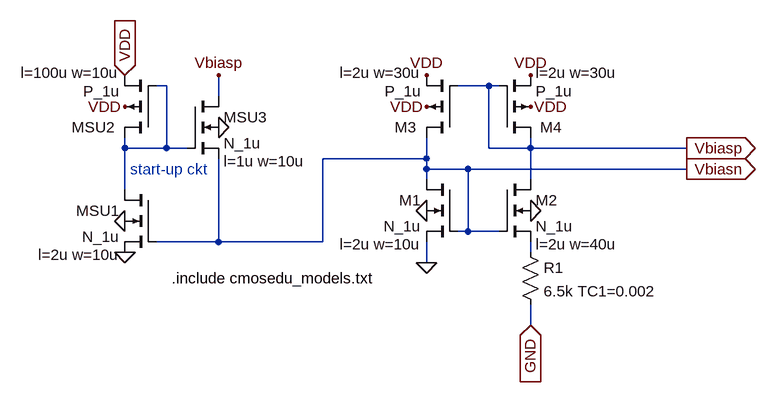
[diagram p0: schematic Fig_20_15.asc]
Fig_20_15.asc, the LTspice schematic file:
Version 4
SHEET 1 1556 680
WIRE 608 -80 592 -80
WIRE 1104 -80 1056 -80
WIRE 1120 -80 1104 -80
WIRE 688 -64 688 -96
WIRE 544 16 544 0
WIRE 608 16 608 -80
WIRE 608 16 544 16
WIRE 640 16 608 16
WIRE 1104 16 1104 -80
WIRE 1168 16 1168 0
WIRE 1168 16 1104 16
WIRE 1408 16 1168 16
WIRE 1008 32 1008 0
WIRE 1008 32 848 32
WIRE 1008 48 1008 32
WIRE 1072 48 1008 48
WIRE 1408 48 1072 48
WIRE 1008 64 1008 48
WIRE 1168 64 1168 16
WIRE 544 80 544 16
WIRE 1072 144 1072 48
WIRE 1072 144 1056 144
WIRE 1120 144 1072 144
WIRE 688 160 688 32
WIRE 688 160 592 160
WIRE 848 160 848 32
WIRE 848 160 688 160
WIRE 544 176 544 160
WIRE 1168 176 1168 160
WIRE 1008 192 1008 160
WIRE 1168 288 1168 256
FLAG 544 -48 VDD
FLAG 544 128 0
FLAG 688 -16 0
FLAG 688 -96 Vbiasp
FLAG 1008 -48 VDD
FLAG 1008 -96 VDD
FLAG 1168 -48 VDD
FLAG 1168 -96 VDD
FLAG 1008 192 0
FLAG 1008 112 0
FLAG 1168 112 0
FLAG 544 -96 VDD
IOPIN 544 -96 In
FLAG 544 176 0
FLAG 1408 16 Vbiasp
IOPIN 1408 16 Out
FLAG 1408 48 Vbiasn
IOPIN 1408 48 Out
FLAG 1168 288 GND
IOPIN 1168 288 In
SYMBOL pmos4 592 0 R180
WINDOW 0 63 16 Left 2
WINDOW 123 56 100 Left 2
SYMATTR InstName MSU2
SYMATTR Value2 l=100u w=10u
SYMATTR Value P_1u
SYMBOL nmos4 592 80 M0
WINDOW 123 56 100 Left 2
SYMATTR Value2 l=2u w=10u
SYMATTR InstName MSU1
SYMATTR Value N_1u
SYMBOL nmos4 640 -64 R0
WINDOW 123 56 100 Left 2
SYMATTR Value2 l=1u w=10u
SYMATTR InstName MSU3
SYMATTR Value N_1u
SYMBOL pmos4 1056 0 R180
WINDOW 0 63 16 Left 2
WINDOW 123 56 100 Left 2
SYMATTR InstName M3
SYMATTR Value2 l=2u w=30u
SYMATTR Value P_1u
SYMBOL pmos4 1120 0 M180
WINDOW 0 63 16 Left 2
WINDOW 123 56 100 Left 2
SYMATTR InstName M4
SYMATTR Value2 l=2u w=30u
SYMATTR Value P_1u
SYMBOL nmos4 1056 64 M0
WINDOW 123 56 100 Left 2
SYMATTR Value2 l=2u w=10u
SYMATTR InstName M1
SYMATTR Value N_1u
SYMBOL nmos4 1120 64 R0
WINDOW 123 56 100 Left 2
SYMATTR Value2 l=2u w=40u
SYMATTR InstName M2
SYMATTR Value N_1u
SYMBOL res 1152 160 R0
SYMATTR InstName R1
SYMATTR Value 6.5k TC1=0.002
TEXT 552 48 Left 2 ;start-up ckt
TEXT 616 216 Left 2 !.include cmosedu_models.txt

The netlist it stands for:
* Fig_20_15.asc
MSU2 N001 N001 VDD VDD P_1u l=100u w=10u
MSU1 N001 Vbiasn 0 0 N_1u l=2u w=10u
MSU3 Vbiasp N001 Vbiasn 0 N_1u l=1u w=10u
M3 Vbiasn Vbiasp VDD VDD P_1u l=2u w=30u
M4 Vbiasp Vbiasp VDD VDD P_1u l=2u w=30u
M1 Vbiasn Vbiasn 0 0 N_1u l=2u w=10u
M2 Vbiasp Vbiasn N002 0 N_1u l=2u w=40u
R1 N002 GND 6.5k TC1=0.002
.model NMOS NMOS
.model PMOS PMOS
.lib standard.mos
* start-up ckt
.include cmosedu_models.txt
.backanno
.end